# EAGLE design SparkFun_GPS_ZED-F9K (EAGLE 9.5.2)
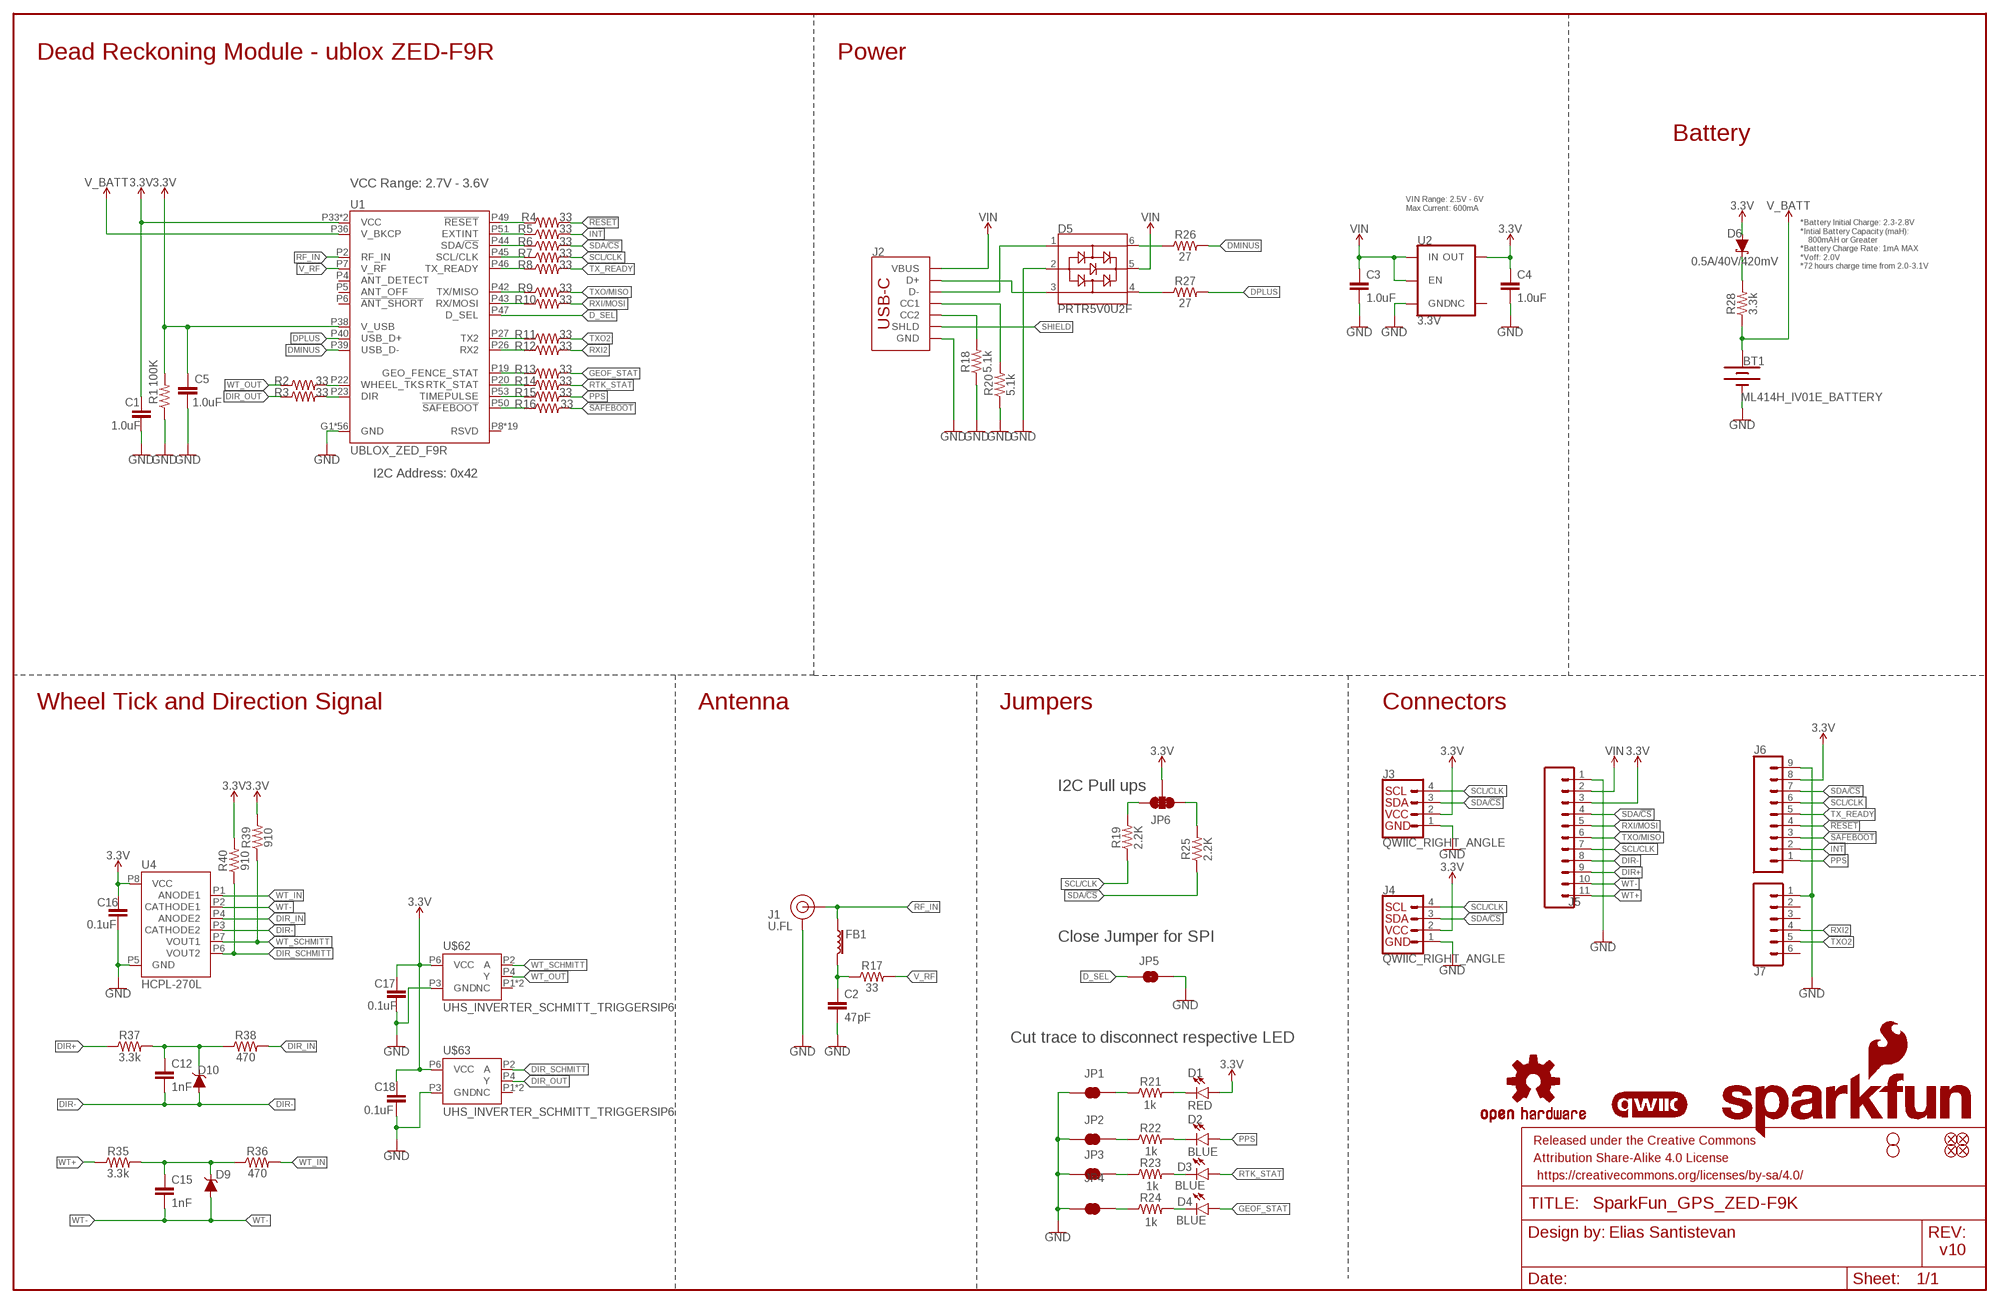
[diagram p0: schematic, sheet 1]

## Parts
$1_36_$_2020-02-13_17-32-45  STAND-OFFTIGHT  [STAND-OFF-TIGHT]
BT1  ML414H_IV01E_BATTERY  [ML414H_IV01E]
C1  1.0uF  1.0UF-0603-16V-10%-X7R  [0603]
C2  47pF  47PF-0402-25V-5%-X7R  [0402]
C3  1.0uF  1.0UF-0603-16V-10%-X7R  [0603]
C4  1.0uF  1.0UF-0603-16V-10%-X7R  [0603]
C5  1.0uF  1.0UF-0603-16V-10%-X7R  [0603]
C12  1nF  1.0NF/1000PF-0402-25V-10%-X7R  [0402]
C15  1nF  1.0NF/1000PF-0402-25V-10%-X7R  [0402]
C16  0.1uF  0.1UF-0402-6.3V-10%-X7R  [0402]
C17  0.1uF  0.1UF-0402-6.3V-10%-X7R  [0402]
C18  0.1uF  0.1UF-0402-6.3V-10%-X7R  [0402]
D1  RED  LED-RED0603  [LED-0603]
D2  BLUE  LED-BLUE0603  [LED-0603]
D3  BLUE  LED-BLUE0603  [LED-0603]
D4  BLUE  LED-BLUE0603  [LED-0603]
D5  PRTR5V0U2F  [SOT886]
D6  0.5A/40V/420mV  DIODE-SCHOTTKY-PMEG4005EJ  [SOD-323]
D9  0.5A/40V/420mV  BZX84_DIODE  [SOT23_BZX]
D10  0.5A/40V/420mV  BZX84_DIODE  [SOT23_BZX]
FB1  120NH  FERRITE_BEAD_GNSS  [0402_MURATA]
FD1  FIDUCIALUFIDUCIAL  [FIDUCIAL-MICRO]
FD2  FIDUCIALUFIDUCIAL  [FIDUCIAL-MICRO]
FD3  FIDUCIALUFIDUCIAL  [FIDUCIAL-MICRO]
FD4  FIDUCIALUFIDUCIAL  [FIDUCIAL-MICRO]
FRAME1  FRAME-LEDGER  [CREATIVE_COMMONS]
H2  STAND-OFFTIGHT  [STAND-OFF-TIGHT]
J1  U.FL  U.FL2PIN  [U.FL]
J2  USB_C_2-LAYER_PADS  [USB-C-16P-2LAYER-PADS]
J3  QWIIC_RIGHT_ANGLE  QWIIC_CONNECTORJS-1MM  [JST04_1MM_RA]
J4  QWIIC_RIGHT_ANGLE  QWIIC_CONNECTORJS-1MM  [JST04_1MM_RA]
J5  CONN_111X11_NO_SILK  [1X11_NO_SILK]
J6  CONN_09NO_SILK  [1X09_NO_SILK]
J7  CONN_06NO_SILK_NO_POP  [1X06_NO_SILK]
JP1  JUMPER-SMT_2_NC_TRACE_SILK  [SMT-JUMPER_2_NC_TRACE_SILK]
JP2  JUMPER-SMT_2_NC_TRACE_SILK  [SMT-JUMPER_2_NC_TRACE_SILK]
JP3  JUMPER-SMT_2_NC_TRACE_SILK  [SMT-JUMPER_2_NC_TRACE_SILK]
JP4  JUMPER-SMT_2_NC_TRACE_SILK  [SMT-JUMPER_2_NC_TRACE_SILK]
JP5  JUMPER-SMT_2_NO_SILK  [SMT-JUMPER_2_NO_SILK]
JP6  JUMPER-SMT_3_2-NC_TRACE_SILK  [SMT-JUMPER_3_2-NC_TRACE_SILK]
LOGO1  OSHW-LOGOM  [OSHW-LOGO-M]
LOGO2  QWIIC_LOGO_4MM  [QWIIC_4MM]
LOGO3  SFE_LOGO_NAME_FLAME.2_INCH  [SFE_LOGO_NAME_FLAME_.2]
R1  100K  100KOHM-0402-1/16W-1%  [0402]
R2  33  33OHM-0402-1/10W-1%  [0402]
R3  33  33OHM-0402-1/10W-1%  [0402]
R4  33  33OHM-0402-1/10W-1%  [0402]
R5  33  33OHM-0402-1/10W-1%  [0402]
R6  33  33OHM-0402-1/10W-1%  [0402]
R7  33  33OHM-0402-1/10W-1%  [0402]
R8  33  33OHM-0402-1/10W-1%  [0402]
R9  33  33OHM-0402-1/10W-1%  [0402]
R10  33  33OHM-0402-1/10W-1%  [0402]
R11  33  33OHM-0402-1/10W-1%  [0402]
R12  33  33OHM-0402-1/10W-1%  [0402]
R13  33  33OHM-0402-1/10W-1%  [0402]
R14  33  33OHM-0402-1/10W-1%  [0402]
R15  33  33OHM-0402-1/10W-1%  [0402]
R16  33  33OHM-0402-1/10W-1%  [0402]
R17  33  33OHM-0603-1/10W-1%  [0603]
R18  5.1k  5.1KOHM-0402-1/16W-1%  [0402]
R19  2.2K  2.2KOHM-0402-1/16W-1%  [0402]
R20  5.1k  5.1KOHM-0402-1/16W-1%  [0402]
R21  1KOHM-0402-1/16W-1%  [0402]
R22  1KOHM-0402-1/16W-1%  [0402]
R23  1KOHM-0402-1/16W-1%  [0402]
R24  1KOHM-0402-1/16W-1%  [0402]
R25  2.2K  2.2KOHM-0402-1/16W-1%  [0402]
R26  27  27OHM-0603-1/10W-1%  [0603]
R27  27  27OHM-0603-1/10W-1%  [0603]
R28  3.3k  3.3KOHM-0603-1/10W-1%  [0603]
R35  3.3k  3.3KOHM-0603-1/10W-1%  [0603]
R36  470  470OHM-0603-1/10W-1%  [0603]
R37  3.3k  3.3KOHM-0603-1/10W-1%  [0603]
R38  470  470OHM-0603-1/10W-1%  [0603]
R39  910  910OHM-0603-1/10W-5%  [0603]
R40  910  910OHM-0603-1/10W-5%  [0603]
U1  UBLOX_ZED_F9R  [UBLOX_ZED_F9R]
U2  3.3V  V_REG_AP2112K-3.3V  [SOT23-5]
U4  HCPL-270L  [SOP_8-PIN]
U$62  UHS_INVERTER_SCHMITT_TRIGGERSIP6  [SIP6]
U$63  UHS_INVERTER_SCHMITT_TRIGGERSIP6  [SIP6]

## Nets
3.3V: C1.1 C4.1 C5.1 C16.1 C17.1 C18.1 D1.A D6.A J3.2 J4.2 J5.3 J6.8 JP6.2 R1.2 R39.2 R40.2 U1.P33(VCC) U1.P34(VCC) U1.P38(V_USB) U2.5(OUT) U4.P8(VCC) U$62.P6(VCC) U$63.P6(VCC)
!RESET: J6.4 R4.2
!SAFEBOOT: J6.3 R16.2
D_SEL: JP5.1 U1.P47(D_SEL)
DIR+: J5.9 R37.1
DIR-: C12.2 D10.P1(A) J5.8 U4.P3(CATHODE2)
DIR_IN: R38.2 U4.P4(ANODE2)
DIR_OUT: R3.1 U$63.P4(Y)
DIR_SCHMITT: R40.1 U4.P6(VOUT2) U$63.P2(A)
DMINUS: R26.2 U1.P39(USB_D-)
DPLUS: R27.2 U1.P40(USB_D+)
GEOF_STAT: D4.A R13.2
GND: BT1.- C1.2 C2.2 C3.2 C4.2 C5.2 C16.2 C17.2 C18.2 D5.2 J1.1(GND) J1.2(GND) J2.GND J2.GND2(GND) J3.1 J4.1 J5.1 J6.9 J7.1 JP1.1 JP2.1 JP3.1 JP4.1 JP5.2 R1.1 R18.1 R20.1 U1.G1(GND) U1.G2(GND) U1.G3(GND) U1.G4(GND) U1.G5(GND) U1.G6(GND) U1.G7(GND) U1.G8(GND) U1.G9(GND) U1.G10(GND) U1.G11(GND) U1.G12(GND) U1.G13(GND) U1.G14(GND) U1.G15(GND) U1.G16(GND) U1.G17(GND) U1.G18(GND) U1.G19(GND) U1.G20(GND) U1.G21(GND) U1.G22(GND) U1.G23(GND) U1.G24(GND) U1.G25(GND) U1.G26(GND) U1.G27(GND) U1.G28(GND) U1.G29(GND) U1.G30(GND) U1.G31(GND) U1.G32(GND) U1.G33(GND) U1.G34(GND) U1.G35(GND) U1.G36(GND) U1.G37(GND) U1.G38(GND) U1.G39(GND) U1.G40(GND) U1.G41(GND) U1.G42(GND) U1.G43(GND) U1.G44(GND) U1.G45(GND) U1.G46(GND) U1.G47(GND) U1.G48(GND) U1.P1(GND) U1.P3(GND) U1.P12(GND) U1.P14(GND) U1.P32(GND) U1.P37(GND) U1.P41(GND) U1.P48(GND) U2.2(GND) U4.P5(GND) U$62.P3(GND) U$63.P3(GND)
INT: J6.2 R5.2
N$1: JP6.1 R25.2
N$2: D6.C R28.2
N$3: JP6.3 R19.2
N$4: D1.C R21.2
N$5: C2.1 FB1.P2 R17.1
N$6: D5.3 J2.A6(D+) J2.B6(D+)
N$7: D5.1 J2.A7(D-) J2.B7(D-)
N$8: JP1.2 R21.1
N$9: D5.6 R26.1
N$10: D5.4 R27.1
N$11: R4.1 U1.P49(!RESET!)
N$12: R5.1 U1.P51(EXTINT)
N$14: J2.B5(CC2) R18.2
N$15: J2.A5(CC1) R20.2
N$16: R6.1 U1.P44(SDA/!CS!)
N$17: R7.1 U1.P45(SCL/CLK)
N$18: R8.1 U1.P46(TX_READY)
N$19: R9.1 U1.P42(TX/MISO)
N$20: R10.1 U1.P43(RX/MOSI)
N$21: R11.1 U1.P27(TX2)
N$22: JP3.2 R23.1
N$23: JP2.2 R22.1
N$24: D2.C R22.2
N$25: D3.C R23.2
N$26: R12.1 U1.P26(RX2)
N$27: R13.1 U1.P19(GEO_FENCE_STAT)
N$28: R14.1 U1.P20(RTK_STAT)
N$29: R15.1 U1.P53(TIMEPULSE)
N$30: R16.1 U1.P50(!SAFEBOOT!)
N$31: R2.2 U1.P22(WHEEL_TKS)
N$32: R3.2 U1.P23(DIR)
N$33: JP4.2 R24.1
N$34: D4.C R24.2
N$35: C15.1 D9.P3(C) R35.2 R36.1
N$37: C12.1 D10.P3(C) R37.2 R38.1
PPS: D2.A J6.1 R15.2
RF_IN [Antenna]: FB1.P1 J1.FEED(SIGNAL) U1.P2(RF_IN)
RTK_STAT: D3.A R14.2
RXI2: J7.4 R12.2
RXI/MOSI: J5.5 R10.2
SCL/CLK: J3.4 J4.4 J5.7 J6.6 R7.2 R19.1
SDA/!CS: J3.3 J4.3 J5.4 J6.7 R6.2 R25.1
SHIELD: J2.SHLD1(SHLD) J2.SHLD2(SHLD) J2.SHLD3(SHLD) J2.SHLD4(SHLD)
TX_READY: J6.5 R8.2
TXO2: J7.5 R11.2
TXO/MISO: J5.6 R9.2
V_BATT: BT1.+ R28.1 U1.P36(V_BKCP)
V_RF: R17.2 U1.P7(V_RF)
VIN: C3.1 D5.5 J2.VBUS1(VBUS) J2.VBUS2(VBUS) J5.2 U2.1(IN) U2.3(EN)
WT+: J5.11 R35.1
WT-: C15.2 D9.P1(A) J5.10 U4.P2(CATHODE1)
WT_IN: R36.2 U4.P1(ANODE1)
WT_OUT: R2.1 U$62.P4(Y)
WT_SCHMITT: R39.1 U4.P7(VOUT1) U$62.P2(A)
Unconnected: J7.2 J7.3 J7.6 U1.P4(ANT_DETECT) U1.P5(ANT_OFF) U1.P6(!ANT_SHORT!) U1.P8(RSVD) U1.P9(RSVD) U1.P10(RSVD) U1.P11(RSVD) U1.P13(RSVD) U1.P15(RSVD) U1.P16(RSVD) U1.P17(RSVD) U1.P18(RSVD) U1.P21(RSVD) U1.P24(RSVD) U1.P25(RSVD) U1.P28(RSVD) U1.P29(RSVD) U1.P30(RSVD) U1.P31(RSVD) U1.P35(RSVD) U1.P52(RSVD) U1.P54(RSVD) U2.4(NC) U$62.P1(NC) U$62.P5(NC) U$63.P1(NC) U$63.P5(NC)

## Notes on the sheet
- Dead Reckoning Module - ublox ZED-F9R | Power
- Battery
- VCC Range: 2.7V - 3.6V
- VIN Range: 2.5V - 6V
  Max Current: 600mA
- *Battery Initial Charge: 2.3-2.8V
  *Intial Battery Capacity (maH): 
      800mAH or Greater
  *Battery Charge Rate: 1mA MAX
  *Voff: 2.0V
  *72 hours charge time from 2.0-3.1V
- I2C Address: 0x42
- Wheel Tick and Direction Signal | Antenna | Jumpers | Connectors
- I2C Pull ups
- Close Jumper for SPI
- Cut trace to disconnect respective LED
- 1k
- 1k
- 1k
- 1k
- Elias Santistevan
- v10

## Library data of the parts
$1_36_$_2020-02-13_17-32-45 H2 = SparkFun-Hardware:STAND-OFF: Stand Off Drill holes for mechanically mounting via screws, standoffs, etc. Note: Use the keepout ring to avoid running the screw head into surrounding components. Variant Overviews STAND-OFF - Mechanical footprint for a #4 phillips button head screw. STAND-OFF-TIGHT - Mechanical footprint for a #4 phillips button head screw, Example SparkFun Products Screw - Phillips Head (1/4", 4-40, 10 pack) <https://www.sparkfun.com/products/10453> (PRT-10453) Screw - Phillips Head (1/2", 4-40, 10 pack) <https://www.sparkfun.com/products/10452> (PRT-10452) Screw - Phillips Head (3/4", 4-40, 10 pack) <https://www.sparkfun.com/products/10451> (PRT-10451) Screw - Phillips Head (1", 4-40, 10 pack) <https://www.sparkfun.com/products/10450> (PRT-10450)
BT1 = SparkFun-Batteries:ML414H_IV01E_BATTERY: SEIKO ML414H-IV01E Reflowable Lithium Battery ML414H is a rechargeable, coin type battery with features such as Pb-free reflowable (Peak temperature: 260 C) and high temperature heat resistance. Battery Characteristics: 3.1V max voltage Voff is 2V 1mAH 3k series resistor with battery 72 hour charge time from 2.0-3.1V 2.3-2.8V initial charge; PROD_ID: BATT-14267
C1 C3-C5 = SparkFun-Capacitors:1.0UF: 1µF ceramic capacitors A capacitor is a passive two-terminal electrical component used to store electrical energy temporarily in an electric field.; PROD_ID: CAP-13930
C2 = SparkFun-Capacitors:47PF: 47pF ceramic capacitors A capacitor is a passive two-terminal electrical component used to store electrical energy temporarily in an electric field.; PROD_ID: CAP-15063
C12 C15 = SparkFun-Capacitors:1.0NF/1000PF: 1nF/1,000pF ceramic capacitors A capacitor is a passive two-terminal electrical component used to store electrical energy temporarily in an electric field.; PROD_ID: CAP-15061
C16-C18 = SparkFun-Capacitors:0.1UF: 0.1µF ceramic capacitors A capacitor is a passive two-terminal electrical component used to store electrical energy temporarily in an electric field.; PROD_ID: CAP-14993
D1 = SparkFun-LED:LED-RED: Red SMD LED Used in manufacturing of most products at SparkFun Packages: 0603 - SMD 0603 package [Product Link] <http://docs.avagotech.com/docs/AV02-0551EN> 0603 SMART - SMD 0603 SMART package ( more efficient and expensive)[Product Link] <http://www.osram-os.com/Graphics/XPic2/00077099_0.pdf> 1206 - SMD1206 package [Product Link] <https://www.sparkfun.com/datasheets/DevTools/LilyPad/Q150OVS4.pdff> SparkFun Products: Pro Mini 328 -5V <https://www.sparkfun.com/products/821> RedBoard <https://www.sparkfun.com/products/12757> IOIO-OTG <https://www.sparkfun.com/products/13613>; PROD_ID: DIO-00819
D2-D4 = SparkFun-LED:LED-BLUE: Blue SMD LED Used in manufacturing of various products at SparkFun Packages: 0603 - SMD 0603 package [Product Link] <http://www.digikey.com/product-detail/en/SMLE12BC7TT86/511-1589-2-ND/1641808> 1206 - SMD1206 package [Product Link] <http://www.digikey.com/product-detail/en/lite-on-inc/LTST-C150TBKT/160-1643-1-ND/573584> SparkFun Products: ESP8266 Thing-Dev Board <https://www.sparkfun.com/products/13711> RedBoard <https://www.sparkfun.com/products/12757>; PROD_ID: DIO-08575
D5 = SparkFun-IC-Power:PRTR5V0U2: A small ESD protection device. Most commonly used on USB D+/D- signals to protect large, expensive, or especially sensitive USB enabled devices.; PROD_ID: DIO-14084
D6 = SparkFun-DiscreteSemi:DIODE-SCHOTTKY: Schottky diode A Schottky diode is a semiconductor diode which has a low forward voltage drop and a very fast switching action.; PROD_ID: DIO-10955
D9 D10 = classified:BZX84_DIODE
FB1 = SparkFun-Coils:FERRITE_BEAD_GNSS
FD1-FD4 = SparkFun-Aesthetics:FIDUCIAL: Fiducial Alignment Points Point-of-reference for pick-and-place machines and other optical instruments.
FRAME1 = SparkFun-Aesthetics:FRAME-LEDGER: Schematic Frame - Ledger Standard 11x14 US Ledger frame
J1 = SparkFun-Connectors:U.FL2PIN: SMD Antenna Connector - U.FL 2mm height, 3.0mm x 3.0mm receptacle size. SparkFun Products: SparkFun WiFi Shield - ESP8266 <https://www.sparkfun.com/products/13287> SparkFun ESP8266 Thing <https://www.sparkfun.com/products/13231> SparkFun MiniGen - Pro Mini Signal Generator Shield <https://www.sparkfun.com/products/11420>; PROD_ID: CONN-09193; SF_ID: WRL-09144
J2 = SparkFun-Connectors:USB_C: USB Type C 16Pin Connector Super Speed pins not available on the 16-pin purely SMD connector so this part is best for USB 2.0 implementations. D1 and D2 are tied together enabling D+/- no matter which way the cable is plugged into the connector. The two channel configuration pins (CC1/2) are exposed. These are normally connected to ground via 5.1k resistors but can be reconfigured for high current/high power applications.; PROD_ID: CONN-14122
J3 J4 = SparkFun-Connectors:QWIIC_CONNECTOR: SparkFun I2C Standard Qwiic Connector An SMD 1mm pitch JST connector makes it easy and quick (get it? Qwiic?) to connect I2C devices to each other. The Qwiic system <http://www.sparkfun.com/qwiic> enables fast and solderless connection between popular platforms and various sensors and actuators. We carry 200mm <https://www.sparkfun.com/products/14204>, 100mm <https://www.sparkfun.com/products/14205>, 50mm <https://www.sparkfun.com/products/14206>, and breadboard friendly <https://www.sparkfun.com/products/14207> Qwiic cables. We also offer 10 pcs strips <https://www.sparkfun.com/products/14323> the SMD connectors.; PROD_ID: CONN-13694
J5 = SparkFun-Connectors:CONN_11: Multi connection point. Often used as Generic Header-pin footprint for 0.1 inch spaced/style header connections On any of the 0.1 inch spaced packages, you can populate with these: Break Away Headers - Straight <https://www.sparkfun.com/products/116> (PRT-00116) Break Away Male Headers - Right Angle <https://www.sparkfun.com/products/553> (PRT-00553) Female Headers <https://www.sparkfun.com/products/115> (PRT-00115) Break Away Headers - Machine Pin <https://www.sparkfun.com/products/117> (PRT-00117) Break Away Female Headers - Swiss Machine Pin <https://www.sparkfun.com/products/743> (PRT-00743) For SCREWTERMINALS and SPRING TERMINALS visit here: Screw Terimnals on SparkFun.com <https://www.sparkfun.com/search/results?term=Screw+Terminals> (5mm/3.5mm/2.54mm spacing) This device is also useful as a general connection point to wire up your design to another part of your project. Our various solder wires solder well into these plated through hole pads. Hook-Up Wire - Assortment (Stranded, 22 AWG) <https://www.sparkfun.com/products/11375> (PRT-11375) Hook-Up Wire - Assortment (Solid Core, 22 AWG) <https://www.sparkfun.com/products/11367> (PRT-11367) View the entire wire category on our website here <https://www.sparkfun.com/categories/141>
J6 = SparkFun-Connectors:CONN_09: Multi connection point. Often used as Generic Header-pin footprint for 0.1 inch spaced/style header connections On any of the 0.1 inch spaced packages, you can populate with these: Break Away Headers - Straight <https://www.sparkfun.com/products/116> (PRT-00116) Break Away Male Headers - Right Angle <https://www.sparkfun.com/products/553> (PRT-00553) Female Headers <https://www.sparkfun.com/products/115> (PRT-00115) Break Away Headers - Machine Pin <https://www.sparkfun.com/products/117> (PRT-00117) Break Away Female Headers - Swiss Machine Pin <https://www.sparkfun.com/products/743> (PRT-00743) For SCREWTERMINALS and SPRING TERMINALS visit here: Screw Terimnals on SparkFun.com <https://www.sparkfun.com/search/results?term=Screw+Terminals> (5mm/3.5mm/2.54mm spacing) This device is also useful as a general connection point to wire up your design to another part of your project. Our various solder wires solder well into these plated through hole pads. Hook-Up Wire - Assortment (Stranded, 22 AWG) <https://www.sparkfun.com/products/11375> (PRT-11375) Hook-Up Wire - Assortment (Solid Core, 22 AWG) <https://www.sparkfun.com/products/11367> (PRT-11367) View the entire wire category on our website here <https://www.sparkfun.com/categories/141> Special notes: Molex polarized connector foot print use with SKU : PRT-08231 with associated crimp pins and housings. 1MM SMD Version SKU: PRT-10208 NOTES ON THE VARIANTS LOCK and LOCK_LONGPADS... This footprint was designed to help hold the alignment of a through-hole component (i.e. 6-pin header) while soldering it into place. You may notice that each hole has been shifted either up or down by 0.005 of an inch from it's more standard position (which is a perfectly straight line). This slight alteration caused the pins (the squares in the middle) to touch the edges of the holes. Because they are alternating, it causes a "brace" to hold the component in place. 0.005 has proven to be the perfect amount of "off-center" position when using our standard breakaway headers. Although looks a little odd when you look at the bare footprint, once you have a header in there, the alteration is very hard to notice. Also,if you push a header all the way into place, it is covered up entirely on the bottom side.
J7 = SparkFun-Connectors:CONN_06: Multi connection point. Often used as Generic Header-pin footprint for 0.1 inch spaced/style header connections On any of the 0.1 inch spaced packages, you can populate with these: Break Away Headers - Straight <https://www.sparkfun.com/products/116> (PRT-00116) Break Away Male Headers - Right Angle <https://www.sparkfun.com/products/553> (PRT-00553) Female Headers <https://www.sparkfun.com/products/115> (PRT-00115) Break Away Headers - Machine Pin <https://www.sparkfun.com/products/117> (PRT-00117) Break Away Female Headers - Swiss Machine Pin <https://www.sparkfun.com/products/743> (PRT-00743) Arduino Stackable Header - 6 Pin <https://www.sparkfun.com/products/9280> (PRT-09280) For SCREWTERMINALS and SPRING TERMINALS visit here: Screw Terimnals on SparkFun.com <https://www.sparkfun.com/search/results?term=Screw+Terminals> (5mm/3.5mm/2.54mm spacing) This device is also useful as a general connection point to wire up your design to another part of your project. Our various solder wires solder well into these plated through hole pads. Hook-Up Wire - Assortment (Stranded, 22 AWG) <https://www.sparkfun.com/products/11375> (PRT-11375) Hook-Up Wire - Assortment (Solid Core, 22 AWG) <https://www.sparkfun.com/products/11367> (PRT-11367) View the entire wire category on our website here <https://www.sparkfun.com/categories/141>
JP1-JP4 = SparkFun-Jumpers:JUMPER-SMT_2_NC_TRACE: Normally closed trace jumper This jumper has a trace between two pads so it's normally closed (NC). Use a razor knife to open the connection. For best results follow the IPC guidelines for cutting traces: Cutout at least 0.063 mm (0.005 in). Remove all loose material to clean up the cut area. Seal the cut with an approved epoxy. Reapply solder to reclose the connection.
JP5 = SparkFun-Jumpers:JUMPER-SMT_2_NO: Normally open jumper This jumper has two pads in close proximity to each other. Apply solder to close the connection. Round pads are easier to solder for beginners, but are a lot larger. SparkFun Product that uses the round pads: SparkFun EL Sequencer <https://www.sparkfun.com/products/12781>
JP6 = SparkFun-Jumpers:JUMPER-SMT_3_2-NC_TRACE: Normally closed trace jumper (2 of 2 connections) This jumper has a trace between all three pads so they are normally closed (NC). Use a razor knife to open the connection(s). For best results follow the IPC guidelines for cutting traces: Cutout at least 0.063 mm (0.005 in). Remove all loose material to clean up the cut area. Seal the cut with an approved epoxy. Reapply solder to reclose the connection(s).
LOGO1 = SparkFun-Aesthetics:OSHW-LOGO: Open-Source Hardware (OSHW) Logo This logo indicates the piece of hardware it is found on incorporates a OSHW license and/or adheres to the definition of open source hardware found here: http://freedomdefined.org/OSHW
LOGO2 = SparkFun-Aesthetics:QWIIC_LOGO: Qwiic Logos for placement on schematic and PCB. The 5.5mm silk logo is best for placing next to Qwiic connector.
LOGO3 = SparkFun-Aesthetics:SFE_LOGO_NAME_FLAME: SparkFun Font Logo w/ Flame This is the SparkFun full logo. The logo on the schematic will always be the same size; the package variant is the height of the flame part of the logo. Default layer for the logo on the board is tSilk.
R1 = SparkFun-Resistors:100KOHM: 100kΩ resistor A resistor is a passive two-terminal electrical component that implements electrical resistance as a circuit element. Resistors act to reduce current flow, and, at the same time, act to lower voltage levels within circuits. - Wikipedia; PROD_ID: RES-13495
R2-R16 = SparkFun-Resistors:33OHM: 33Ω resistor A resistor is a passive two-terminal electrical component that implements electrical resistance as a circuit element. Resistors act to reduce current flow, and, at the same time, act to lower voltage levels within circuits. - Wikipedia; PROD_ID: RES-14883
R17 = SparkFun-Resistors:33OHM: 33Ω resistor A resistor is a passive two-terminal electrical component that implements electrical resistance as a circuit element. Resistors act to reduce current flow, and, at the same time, act to lower voltage levels within circuits. - Wikipedia; PROD_ID: RES-08270
R18 R20 = SparkFun-Resistors:5.1KOHM; PROD_ID: RES-14340
R19 R25 = SparkFun-Resistors:2.2KOHM: 2.2kΩ resistor A resistor is a passive two-terminal electrical component that implements electrical resistance as a circuit element. Resistors act to reduce current flow, and, at the same time, act to lower voltage levels within circuits. - Wikipedia; PROD_ID: RES-14341
R21-R24 = SparkFun-Resistors:1KOHM: 1kΩ resistor A resistor is a passive two-terminal electrical component that implements electrical resistance as a circuit element. Resistors act to reduce current flow, and, at the same time, act to lower voltage levels within circuits. - Wikipedia; PROD_ID: RES-14342
R26 R27 = SparkFun-Resistors:27OHM: 27Ω resistor A resistor is a passive two-terminal electrical component that implements electrical resistance as a circuit element. Resistors act to reduce current flow, and, at the same time, act to lower voltage levels within circuits. - Wikipedia; PROD_ID: RES-09334
R28 R35 R37 = SparkFun-Resistors:3.3KOHM: 3.3kΩ resistor A resistor is a passive two-terminal electrical component that implements electrical resistance as a circuit element. Resistors act to reduce current flow, and, at the same time, act to lower voltage levels within circuits. - Wikipedia; PROD_ID: RES-07851
R36 R38 = SparkFun-Resistors:470OHM: 470Ω resistor A resistor is a passive two-terminal electrical component that implements electrical resistance as a circuit element. Resistors act to reduce current flow, and, at the same time, act to lower voltage levels within circuits. - Wikipedia; PROD_ID: RES-07869
R39 R40 = classified:910OHM-0603-1/10W-5%: 910 Ohm Resistor Digikey Link <https://www.digikey.com/product-detail/en/yageo/RC0603JR-07910RL/311-910GRTR-ND/726838>
U1 = classified:UBLOX_ZED_F9R: u-blox ZED-F9K ADR GPS Unit with Real Time Kinematics (RTK) and internal IMU = Automotive Dead Reckoning; PROD_ID: IC-14716
U2 = SparkFun-IC-Power:V_REG_AP2112: AP2112 - 600mA CMOS LDO Regulator w/ Enable The AP2112 is CMOS process low dropout linear regulator with enable function, the regulator delivers a guaranteed 600mA (min.) continuous load current. Features Output Voltage Accuracy: ±1.5% Output Current: 600mA (Min.) Foldback Short Current Protection: 50mA Enable Function to Turn ON/OFF VOUT Low Dropout Voltage (3.3V): 250mV (Typ.) @IOUT=600mA Excellent Load Regulation: 0.2%/A (Typ.) Excellent Line Regulation: 0.02%/V (Typ.) Low Quiescent Current: 55μA (Typ.) Low Standby Current: 0.01μA (Typ.) Low Output Noise: 50μVRMS PSRR: 100Hz -65dB, 1kHz -65dB OTSD Protection Stable with 1.0μF Flexible Cap: Ceramic, Tantalum and Aluminum Electrolytic Operation Temperature Range: -40°C to 85°C ESD: MM 400V, HBM 4000V; PROD_ID: VREG-12457
U4 = classified:HCPL-270L: HCPL-270L These high gain series couplers use a Light Emitting Diode and an integrated high gain photodetector to provide extremely high current transfer ratio between input and output. Separate pins for the photodiode and output stage result in LVTTL compatible saturation voltages and high speed operation. Where desired, the VCC and VO terminals may be tied together to achieve conventional photo-darlington operation. A base access terminal allows a gain bandwidth adjustment to be made. These optocouplers are for use in LVTTL/LVCMOS or other low power applications. A 400% minimum current transfer ratio is guaranteed over 0 to +70˚C operating range for only 0.5 mA of LED current. Digikey Link <https://www.digikey.com/products/en?mpart=HCPL-070L-500E&v=516>
U$62 U$63 = classified:UHS_INVERTER_SCHMITT_TRIGGER: NC7SZ14 The NC7SZ14 is a single inverter with Schmitt trigger input from ON Semiconductor’s Ultra−High Speed (UHS) series of TinyLogic. The device is fabricated w ith advanced CMOS technology to achieve ultra−high speed with high output drive while maintaining low static power dissipation over a very broad VCC operating range. The device is specified to operate over the 1.65 V to 5.5 V VCC range. The inputs and outputs are high−impedance when VCC is 0 V. Inputs tolerate voltages up to 5.5 V independent of VCC operating voltage. Digikey Link <https://www.digikey.com/product-detail/en/on-semiconductor/NC7SZ14M5X/NC7SZ14M5XDKR-ND/1628606>

## Net classes
1 Antenna: width 1 mm, clearance 0.3 mm

## Board
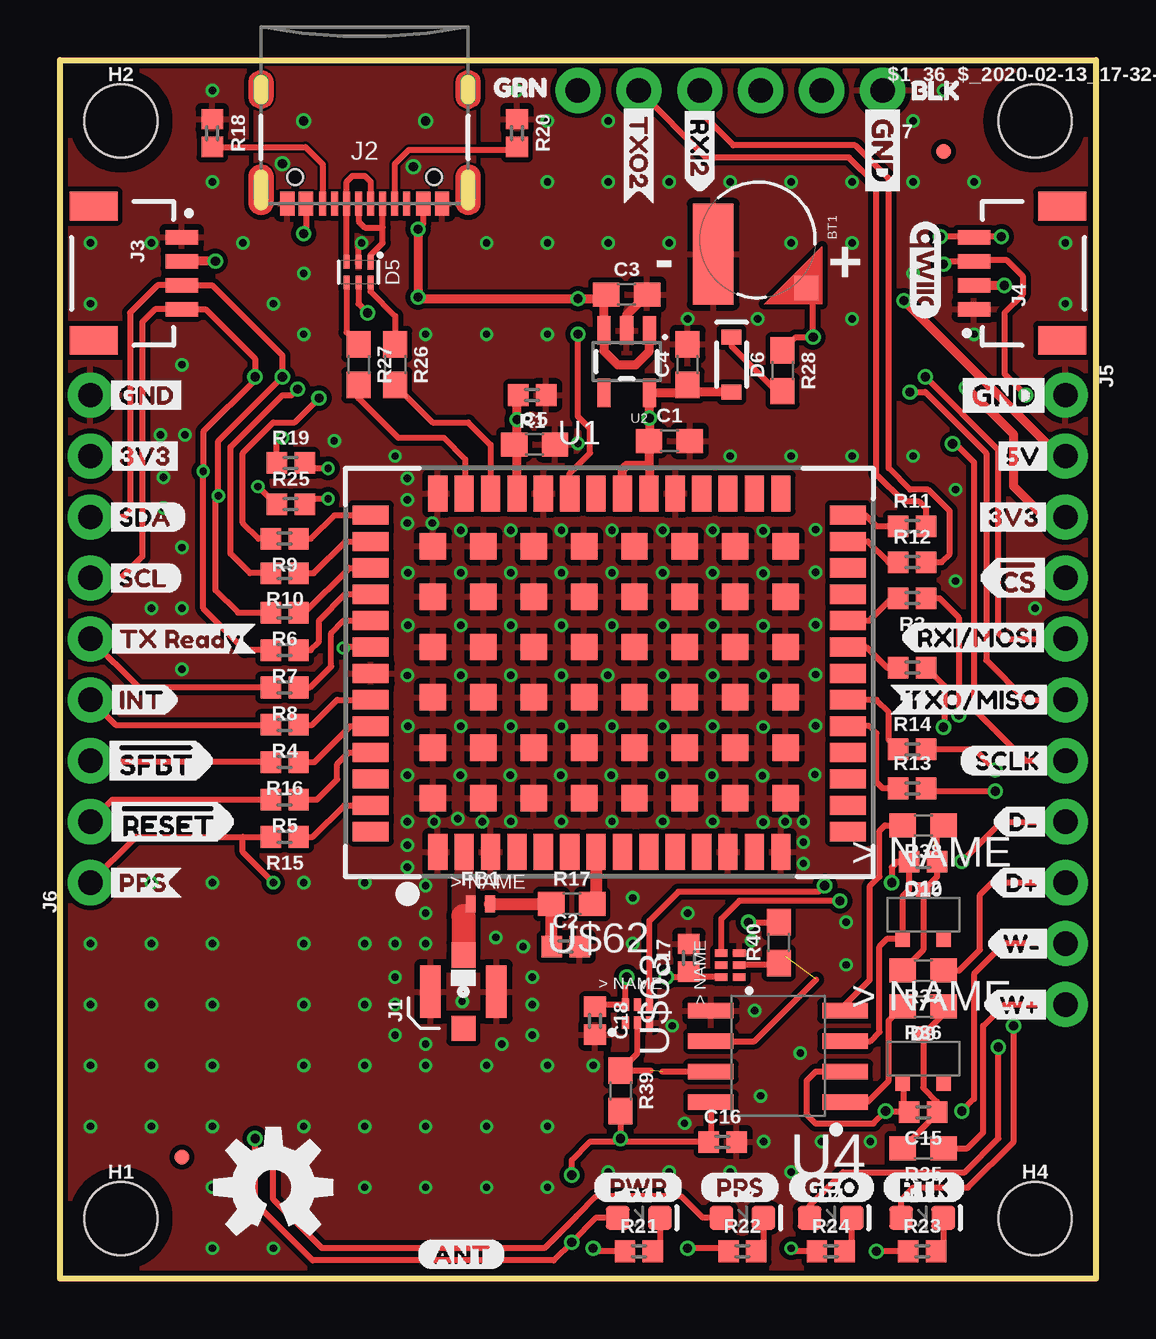
[diagram p1: board, top side]
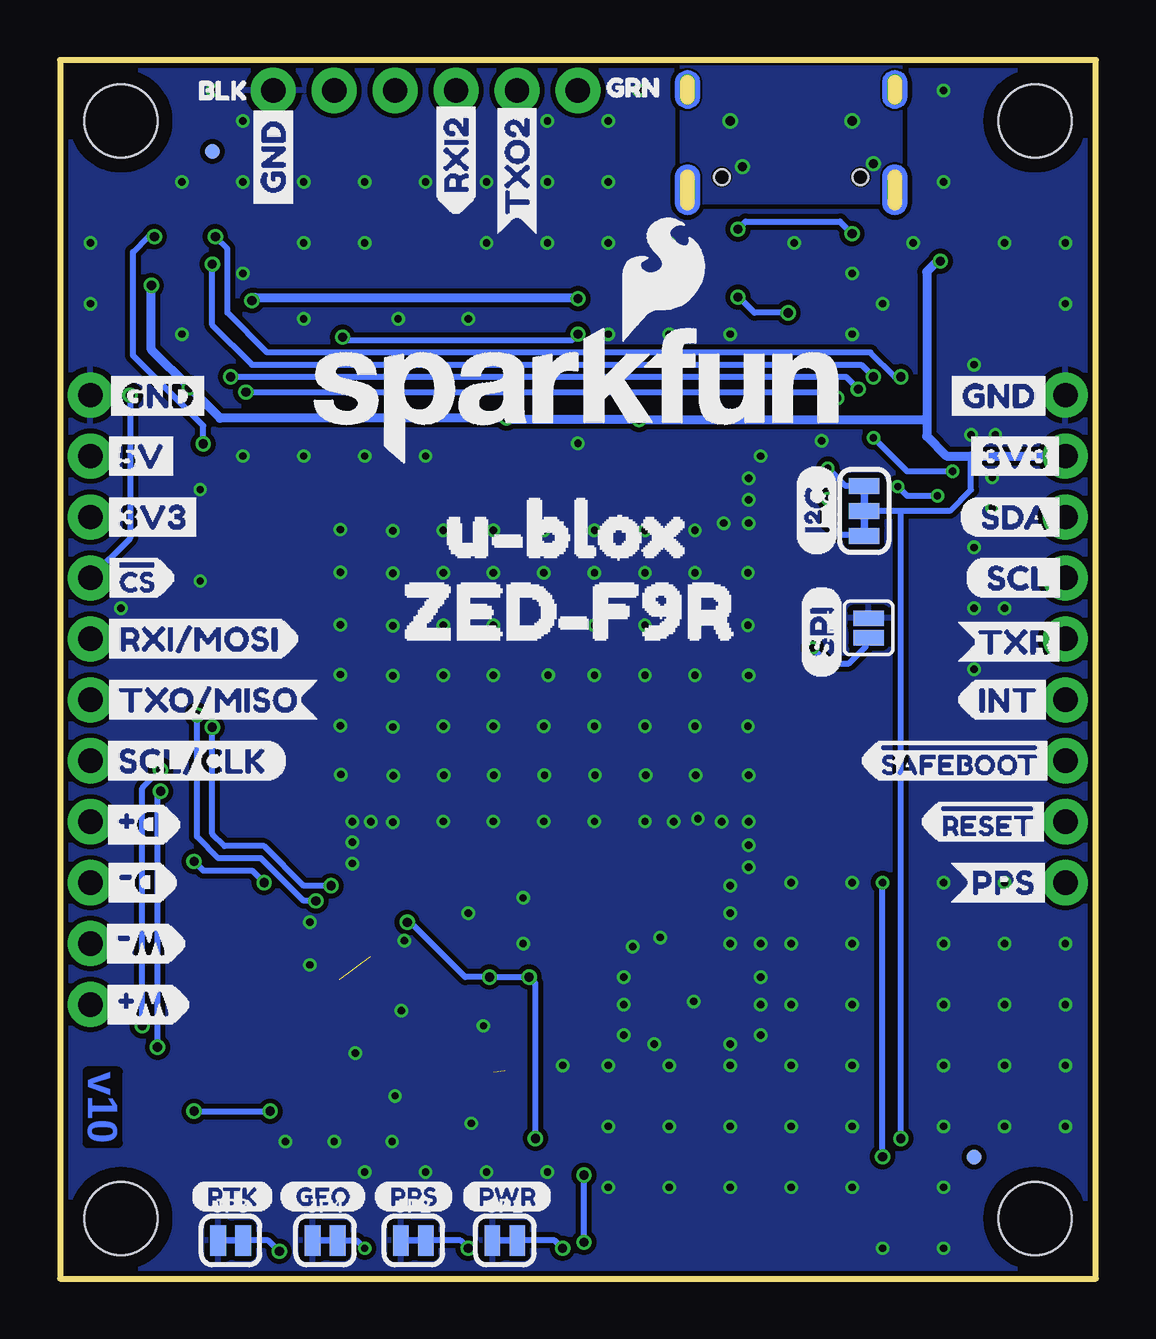
[diagram p2: board, bottom side, seen from below]

Size 43.18 x 50.8 mm. Coordinates in mm from the lower left corner, seen from the top.
Outline: 0,0 0,50.8 43.18,50.8 43.18,0 0,0
Copper layers (1*16): Top 0.035mm / dielectric 1.5mm / Bottom 0.035mm
Design rules "SparkFun-2-layer-FAB-LIMIT": minimum track width 4mil, minimum drill 6mil, track to track 4mil, track to pad 4mil, pad to pad 4mil, via to via 4mil, smd to smd 4mil, copper to edge 4mil, drill to drill 4mil, minimum pad ring 5mil, minimum via ring 5mil, stop-mask expansion 4mil, vias tented up to drill 25mil, thermal gap 10mil

### Footprints (pad centres in the part's own frame; a part is rotated, then mirrored left to right if it is on the bottom)
STAND-OFF-TIGHT = hole 3.048: 0,0
ML414H_IV01E = smd 1 x 1: + 2.022,2.032 | smd 4.2 x 1.7: - 0.6,-1.85
0603 = smd 1.1 x 1: 1 -0.85,0; 2 0.85,0
0402 = smd 0.85 x 0.9: 1 -0.58,0; 2 0.58,0
LED-0603 = smd 1 x 1: A -0.877,0; C 0.877,0
SOT886 = smd 0.61 x 0.25: 1 -0.405,0.5 | smd 0.56 x 0.25: 2 -0.43,0; 3 -0.43,-0.5; 4 0.43,-0.5; 5 0.43,0; 6 0.43,0.5
SOD-323 = smd 0.63 x 0.83: A 1.15,0; C -1.15,0
SOT23_BZX = smd 0.6 x 0.7: P1 -0.85,-0.984; P2 0.85,-0.984; P3 0,1.016
0402_MURATA = smd 0.4 x 0.7: P1 -0.4,0; P2 0.4,0
FIDUCIAL-MICRO = smd 0.635 x 0.635: 1 0,0
U.FL = smd 2.2 x 0.85: 1 0,1.375; 2 0,-1.375 | smd 1.05 x 1: FEED 1.525,0; NC -1.525,0
USB-C-16P-2LAYER-PADS = smd 0.3 x 1: A5 -1.25,-0.34; A6 -0.25,-0.34; A7 0.25,-0.34; A8 1.25,-0.34; B5 1.75,-0.34; B6 0.75,-0.34; B7 -0.75,-0.34; B8 -1.75,-0.34 | smd 0.6 x 1: GND -3.225,-0.34; GND2 3.225,-0.34; VBUS1 -2.45,-0.34; VBUS2 2.45,-0.34 | drill 0.4 pad 0.6 long: SHLD1 -4.318,-0.915; SHLD2 4.318,-0.915; SHLD3 -4.318,-5.095; SHLD4 4.318,-5.095 | hole 0.65: -2.89,-1.445; 2.89,-1.445
JST04_1MM_RA = smd 0.6 x 1.35: 1 -1.5,0; 2 -0.5,0; 3 0.5,0; 4 1.5,0 | smd 1.2 x 2: NC1 2.8,-3.675; NC2 -2.8,-3.675
1X11_NO_SILK = drill 1.016 pad 1.88: 1 0,0; 2 2.54,0; 3 5.08,0; 4 7.62,0; 5 10.16,0; 6 12.7,0; 7 15.24,0; 8 17.78,0; 9 20.32,0; 10 22.86,0; 11 25.4,0
1X09_NO_SILK = drill 1.016 pad 1.88: 1 0,0; 2 2.54,0; 3 5.08,0; 4 7.62,0; 5 10.16,0; 6 12.7,0; 7 15.24,0; 8 17.78,0; 9 20.32,0
1X06_NO_SILK = drill 1.016 pad 1.88: 1 0,0; 2 2.54,0; 3 5.08,0; 4 7.62,0; 5 10.16,0; 6 12.7,0
SMT-JUMPER_2_NC_TRACE_SILK = smd 0.66 x 1.27: 1 -0.521,0; 2 0.521,0
SMT-JUMPER_2_NO_SILK = smd 0.635 x 1.27: 1 -0.406,0; 2 0.406,0
SMT-JUMPER_3_2-NC_TRACE_SILK = smd 0.66 x 1.27: 1 -1.041,0; 2 0,0; 3 1.041,0
UBLOX_ZED_F9R = smd 1.1 x 1.1: G1 -7.312,-5.37; G2 -5.212,-5.37; G3 -3.112,-5.37; G4 -1.012,-5.37; G5 1.088,-5.37; G6 3.188,-5.37; G7 5.288,-5.37; G8 7.388,-5.37; G9 7.388,-3.27; G10 5.288,-3.27; G11 3.188,-3.27; G12 1.088,-3.27; G13 -1.012,-3.27; G14 -3.112,-3.27; G15 -5.212,-3.27; G16 -7.312,-3.27; G17 -7.312,-1.17; G18 -5.212,-1.17; G19 -3.112,-1.17; G20 -1.012,-1.17; G21 1.088,-1.17; G22 3.188,-1.17; G23 5.288,-1.17; G24 7.388,-1.17; G25 7.388,0.93; G26 5.288,0.93; G27 3.188,0.93; G28 1.088,0.93; G29 -1.012,0.93; G30 -3.112,0.93; G31 -5.212,0.93; G32 -7.312,0.93; G33 -7.312,3.03; G34 -5.212,3.03; G35 -3.112,3.03; G36 -1.012,3.03; G37 1.088,3.03; G38 3.188,3.03; G39 5.288,3.03; G40 7.388,3.03; G41 7.388,5.13; G42 5.288,5.13; G43 3.188,5.13; G44 1.088,5.13; G45 -1.012,5.13; G46 -3.112,5.13; G47 -5.212,5.13; G48 -7.312,5.13 | smd 0.8 x 1.5: P1 -7.112,-7.62; P2 -6.012,-7.62; P3 -4.912,-7.62; P4 -3.812,-7.62; P5 -2.712,-7.62; P6 -1.612,-7.62; P7 -0.512,-7.62; P8 0.588,-7.62; P9 1.688,-7.62; P10 2.788,-7.62; P11 3.888,-7.62; P12 4.988,-7.62; P13 6.088,-7.62; P14 7.188,-7.62; P28 7.188,7.33; P29 6.088,7.33; P30 4.988,7.33; P31 3.888,7.33; P32 2.788,7.33; P33 1.688,7.33; P34 0.588,7.33; P35 -0.512,7.33; P36 -1.612,7.33; P37 -2.712,7.33; P38 -3.812,7.33; P39 -4.912,7.33; P40 -6.012,7.33; P41 -7.112,7.33 | smd 1.5 x 0.8: P15 9.988,-6.77; P16 9.988,-5.67; P17 9.988,-4.57; P18 9.988,-3.47; P19 9.988,-2.37; P20 9.988,-1.27; P21 9.988,-0.17; P22 9.988,0.93; P23 9.988,2.03; P24 9.988,3.13; P25 9.988,4.23; P26 9.988,5.33; P27 9.988,6.43; P42 -9.912,6.43; P43 -9.912,5.33; P44 -9.912,4.23; P45 -9.912,3.13; P46 -9.912,2.03; P47 -9.912,0.93; P48 -9.912,-0.17; P49 -9.912,-1.27; P50 -9.912,-2.37; P51 -9.912,-3.47; P52 -9.912,-4.57; P53 -9.912,-5.67; P54 -9.912,-6.77
SOT23-5 = smd 0.55 x 1.2: 1 -0.95,-1.3; 2 0,-1.3; 3 0.95,-1.3; 4 0.95,1.3; 5 -0.95,1.3
SOP_8-PIN = smd 1.9 x 0.64: P1 -2.921,2.032; P2 -2.921,0.762; P3 -2.921,-0.508; P4 -2.921,-1.778; P5 2.679,-1.778; P6 2.679,-0.508; P7 2.679,0.762; P8 2.679,2.032
SIP6 = smd 0.3 x 0.52: P1 -0.508,-0.381; P2 -0.008,-0.381; P3 0.492,-0.381; P4 0.492,0.369; P5 -0.008,0.369; P6 -0.508,0.369

### Placement (x,y rotation side)
$1_36_$_2020-02-13_17-32-45  40.64,48.26 0 top
BT1  29.08,43.31 270 top
C1  25.4,34.92 0 top
C2  21.08,13.84 0 top
C3  23.62,41.02 0 top
C4  26.16,38.1 90 top
C5  19.79,34.77 0 top
C12  35.98,17.38 180 top
C15  35.98,6.94 180 top
C16  27.62,5.7 0 top
C17  26.21,13.38 90 top
C18  22.3,10.75 270 top
D1  24.13,2.54 0 top
D2  28.45,2.54 0 top
D3  35.94,2.54 0 top
D4  32.13,2.54 0 top
D5  12.45,41.96 270 top
D6  27.99,38.1 270 top
D9  35.98,9.16 0 top
D10  35.98,15.16 0 top
FB1  17.53,15.62 0 top
FD1  5.08,5.08 0 top
FD2  5.08,5.08 0 bottom
FD3  36.83,46.99 0 top
FD4  36.83,46.99 0 bottom
FRAME1  1.78,-16.26 0 top  (outside the outline)
H1  STAND-OFFTIGHT  [STAND-OFF-TIGHT]  2.54,2.51 0 top
H2  2.54,48.26 0 top
H4  STAND-OFFTIGHT  [STAND-OFF-TIGHT]  40.64,2.51 0 top
J1  16.81,11.96 90 top
J2  12.7,44.48 180 top
J3  5.08,41.91 270 top
J4  38.1,41.91 90 top
J5  41.91,36.83 270 top
J6  1.27,16.51 90 top
J7  34.29,49.53 180 top
JP1  24.64,1.6 0 bottom
JP2  28.45,1.6 0 bottom
JP3  36.07,1.6 0 bottom
JP4  32.13,1.6 0 bottom
JP5  9.47,27.13 90 bottom
JP6  9.65,32 90 bottom
LOGO1  8.89,3.81 0 top
LOGO2  36.07,42.04 270 top
LOGO3  21.59,36.83 0 bottom
R1  19.68,36.83 180 top
R2  35.52,25.47 180 top
R3  35.52,28.37 180 top
R4  9.37,23.09 180 top
R5  9.37,19.97 180 top
R6  9.37,27.76 180 top
R7  9.37,26.2 180 top
R8  9.37,24.64 180 top
R9  9.37,30.84 180 top
R10  9.37,29.41 180 top
R11  35.52,31.37 0 top
R12  35.52,29.87 0 top
R13  35.52,20.44 0 top
R14  35.52,22.06 0 top
R15  9.37,18.41 180 top
R16  9.37,21.53 180 top
R17  21.34,15.62 0 top
R18  6.35,47.75 270 top
R19  9.62,34 0 top
R20  19.05,47.75 270 top
R21  24.13,1.14 0 top
R22  28.45,1.14 0 top
R23  35.94,1.14 0 top
R24  32.13,1.14 0 top
R25  9.62,32.28 0 top
R26  13.97,38.1 270 top
R27  12.45,38.1 270 top
R28  30.12,37.85 270 top
R35  35.98,5.45 180 top
R36  35.98,11.35 180 top
R37  35.98,12.85 180 top
R38  35.98,18.9 180 top
R39  23.36,7.83 270 top
R40  29.97,14.01 90 top
U1  22.86,25.4 0 top
U2  23.62,38.23 180 top
U4  29.81,9.39 180 top
U$1  [INT2]  1.78,24.13 0 top
U$2  [PPS4]  1.78,16.51 0 top
U$3  [3V32]  1.78,34.29 0 top
U$4  [PPS8]  26.67,3.81 0 top
U$5  [PWR10]  22.23,3.81 0 top
U$6  [GND3]  1.78,36.83 0 top
U$7  [#RESET2]  7.49,19.05 0 bottom
U$8  [RTK9]  34.29,3.81 0 top
U$9  [RXI#MOSI5]  35.02,26.73 0 top
U$10  [D#0]  38.73,16.51 0 top
U$11  [SCL0]  1.78,29.21 0 top
U$12  [SDA1]  1.78,31.75 0 top
U$13  [D#1]  38.86,19.05 0 top
U$14  [RXI22]  26.67,49.02 270 top
U$15  [TXO#MISO6]  34.54,24.13 0 top
U$16  [TX_READY0]  1.78,26.67 0 top
U$17  [GND-03]  37.21,36.83 0 top
U$18  [5V0]  38.73,34.29 0 top
U$19  [3V32]  37.97,31.75 0 top
U$20  [GND-03]  34.29,49.15 270 top
U$21  [BLK2]  34.8,49.53 0 top
U$22  [RTK9]  37.72,3.43 0 bottom
U$23  [GRN1]  17.4,49.66 0 top
U$24  [INT2]  5.84,24.13 0 bottom
U$25  [TXO21]  24.13,49.15 270 top
U$26  [CS#-<]-04]  38.1,29.21 0 top
U$27  [PPS1]  6.1,16.51 0 bottom
U$28  [#SAFEBOOT3]  10.03,21.59 0 bottom
U$29  [3V3-04]  41.66,31.75 0 bottom
U$30  [RXI#MOSI0]  41.66,26.67 0 bottom
U$31  [GND-04]  41.53,36.8 0 bottom
U$32  [W#2]  38.48,11.43 0 top
U$33  [5V]  41.66,34.29 0 bottom
U$34  [GND-04]  34.29,44.32 90 bottom
U$35  [RXI28]  26.67,44.32 90 bottom
U$36  [TXO21]  24.13,43.43 90 bottom
U$37  [TXO#MISO1]  41.66,24.13 0 bottom
U$38  [SCL#CLK2]  41.66,21.59 0 bottom
U$39  [SCL5]  5.46,29.21 0 bottom
U$40  [3V3-04]  5.71,34.29 0 bottom
U$41  [GND-04]  6.48,36.8 0 bottom
U$42  [SDA4]  5.71,31.75 0 bottom
U$43  [TXR3]  5.84,26.54 0 bottom
U$44  [#RESET1]  1.52,19.05 0 top
U$45  [SPI4]  11.43,25.02 90 bottom
U$46  [I_SUPER2_C-()-04]  11.63,30.14 90 bottom
U$47  [PPS8]  30.1,3.43 0 bottom
U$48  [PWR10]  26.42,3.43 0 bottom
U$49  [ANT0]  14.86,1.02 0 top
U$50  [W#3]  38.61,13.97 0 top
U$51  [ZED#F9R0]  30.86,27.81 0 bottom
U$52  [U#BLOX1]  29.21,31.24 0 bottom
U$53  [GRN1]  21.08,49.66 0 bottom
U$54  [BLK2]  38.1,49.53 0 bottom
U$55  [#SFBT0]  1.4,21.59 0 top
U$56  [GEO1]  30.35,3.81 0 top
U$57  [SCLK2]  37.47,21.59 0 top
U$58  [GEO1]  34.04,3.43 0 bottom
U$59  [CS#-[>-04]  41.78,29.21 0 bottom
U$60  [D#0]  38.1,18.92 180 bottom
U$61  [D#1]  38.23,16.51 180 bottom
U$62  24.08,11.05 0 top
U$63  27.94,13.08 90 top
U$64  [W#2]  37.72,11.43 180 bottom
U$65  [W#3]  37.85,13.97 180 bottom

### Tracks (layer width: path | path; a pad name or v marks a point on that pad's centre or on a via)
3.3V  (via drill 0.38)
  Top 0.254: D1.A 22.35,2.54 v21.34,1.52 20.57,0.76 10.54,0.76 8.13,3.17 v8.13,5.84 | U4.P8 27.13,5.79 C16.1 23.37,5.7 | C18.1 22.39,11.42 U$62.P6 23.57,12.52 v23.62,12.57 | v21.34,4.32 21.34,4.96 22.08,5.7 23.37,5.7 | R39.2 v23.36,5.84 23.36,5.71 23.37,5.7 | v28.7,14.86 R40.2 | v25.27,12.57 25.99,12.57 C17.1 26.44,12.57 U$63.P6
  Top 0.381: U1.P33 24.57,32.75 24.57,33.91 | U1.P34 23.45,33.73 23.62,33.91 24.57,33.91 | J4.2 v39.37,41.4 | v6.48,42.42 J3.2 | J5.3 41.02,31.75 39.75,33.02 39.75,35.18 v37.78,37.15 | D6.A 26.46,36.95 C4.1 25.84,36.93 U2.5 v24.57,35.87 24.57,34.94 C1.1 24.55,33.92 24.57,33.91 | U1.P38 19.05,34.66 C5.1 19.05,34.89 v19.05,35.81 19.05,36.77 R1.2
  Bottom 0.254: 8.13,32 6.1,32 5.21,32.89 5.21,34.29 | 8.13,32 JP6.2 | v21.34,1.52 v21.34,4.32 | v28.7,14.86 28.57,14.86 26.29,12.57 v25.27,12.57 v23.62,12.57 23.37,12.32 v23.37,5.85 v23.36,5.84 | v8.13,5.84 8.13,32
  Bottom 0.381: v39.37,41.4 39.37,38.73 v37.78,37.15 36.5,35.87 v24.57,35.87 24.51,35.81 v19.05,35.81 7.05,35.81 | v6.48,42.42 6.6,42.42 7.05,41.97 7.05,35.81 | J6.8 5.21,34.29 6.22,34.29 7.05,35.12 7.05,35.81
!RESET
  Top 0.254: J6.4 2.31,23.09 R4.2
!SAFEBOOT
  Top 0.254: R16.2 1.33,21.53 J6.3
D_SEL  (via drill 0.3)
  Top 0.254: U1.P47 11.85,26.33 v11.81,26.29
  Bottom 0.254: v11.81,26.29 11.18,25.65 10.29,25.65 9.6,26.34 9.6,26.59 JP5.1
DIR+
  Top 0.254: R37.1 37.49,12.85 38.35,13.72 38.35,16 38.86,16.51 J5.9
DIR-  (via drill 0.38)
  Top 0.254: v34.67,16.51 34.67,17.14 34.9,17.38 C12.2 35.4,16.23 35.13,15.96 D10.P1 34.5,14.18 34.16,13.84 34.16,10.29 33.78,9.9 U4.P3 | v37.59,17.4 39.24,19.05 J5.8
  Bottom 0.254: v37.59,17.4 37.21,17.02 35.18,17.02 v34.67,16.51
DIR_IN
  Top 0.254: U4.P4 32.73,11.43 33.75,12.44 33.75,16.35 34.16,16.76 34.16,18.67 34.39,18.9 R38.2
DIR_OUT  (via drill 0.38)
  Top 0.254: R3.1 36.66,28.37 37.47,27.56 v37.47,23.5 | U$63.P4 27.57,15 28.32,15.75 v32.51,15.75
  Bottom 0.254: v32.51,15.75 33.02,15.75 34.8,17.53 36.58,17.53 37.47,18.41 v37.47,23.5
DIR_SCHMITT  (1 unrouted)
  Top 0.254: U4.P6 28.95,9.9 31.52,12.47 | U$63.P2 29.88,13.07 R40.1 30.24,13.43
DMINUS
  Top 0.254: R26.2 15.53,35.69 17.02,35.69 17.95,34.76 U1.P39
DPLUS
  Top 0.254: U1.P40 16.89,32.77 16.89,34.16 16,35.05 14.1,35.05 12.45,36.7 R27.2
GEOF_STAT  (via drill 0.38)
  Top 0.254: D4.A 31.25,3.06 32.64,4.45 37.72,4.45 39.12,5.84 v39.12,9.65 | v38.99,20.32 36.22,20.32 R13.2
  Bottom 0.254: v39.12,9.65 39.12,20.19 v38.99,20.32
GND  (via drill 0.3)
  Top 0.254: D5.2 12.45,43.05 v12.57,43.18
  Top 0.381: U2.2 23.62,40.17 C3.2
  other vias: 14.48,31.5 16.71,31.2 18.79,31.2 20.9,31.2 23.01,31.2 25.12,31.2 27.2,31.2 29.31,31.18 31.49,31.23 14.5,29.42 16.71,29.42 18.79,29.42 20.9,29.42 23.01,29.42 25.12,29.42 27.2,29.42 29.31,29.4 31.49,29.45 14.5,27.24 16.71,27.24 18.79,27.24 20.9,27.24 23.01,27.24 25.12,27.24 27.2,27.24 29.31,27.21 31.49,27.26 14.48,25.15 16.71,25.16 18.79,25.16 20.9,25.16 25.12,25.16 27.2,25.16 29.31,25.13 31.49,25.18 14.5,23.02 16.71,23.02 18.79,23.02 20.9,23.02 23.01,23.02 25.12,23.02 27.2,23.02 29.31,23 31.49,23.05 14.48,20.99 16.69,20.99 18.77,20.99 20.88,20.99 22.99,20.99 25.09,20.99 27.18,20.99 29.28,20.97 31.47,21.02 14.48,19.05 16.58,19.18 18.79,19.06 20.9,19.06 23.01,19.06 25.12,19.06 27.2,19.06 29.31,19.04 30.23,19.05 13.97,11.43 12.7,3.81 12.7,6.35 12.7,16.51 6.35,16.51 6.35,6.35 6.35,3.81 6.35,1.27 8.89,1.27 3.81,16.51 3.81,6.35 1.27,6.35 5.08,30.48 5.08,27.94 4.32,33.4 5.08,38.1 10.16,39.37 10.16,41.91 7.62,43.18 8.89,40.64 40.64,27.94 33.02,34.29 30.48,34.29 27.94,34.29 14.48,33.36 14.48,32.47 15.52,31.5 30.99,17.31 30.99,18.2 30.99,19.05 20.32,43.18 22.86,43.18 25.4,43.18 25.4,45.72 22.86,45.72 20.32,45.72 17.78,43.18 22.86,48.26 19.05,49.53 20.32,48.26 27.94,45.72 30.48,45.72 30.48,43.18 33.02,43.18 33.02,45.72 35.56,45.72 35.56,48.26 36.83,49.53 38.1,45.72 41.91,43.18 41.91,40.64 15.24,13.97 15.24,15.24 19.68,11.43 19.68,12.57 19.68,10.16 18.41,9.78 15.24,9.78 13.97,10.16 13.97,12.57 20.32,39.37 17.78,39.37 15.24,39.37 14.48,18.07 14.48,17.16 15.59,19.05 10.16,3.81 13.97,34.29 1.27,43.18 1.27,40.64 6.35,49.53 33.02,40.01 29.08,40.01 26.16,40.01 3.81,43.18 6.35,45.72 5.21,35.18 38.1,39.37 35.56,41.91 10.16,6.35 10.16,16.51 29.34,5.71 5.08,25.4 11.43,34.92 35.56,34.29 37.34,29.08 13.97,13.97 15.24,16.38 18.16,14.22 17.6,19.05 16.76,11.56 22.83,25.16 37.34,32.89 4.32,32.13 4.19,35.18 3.81,27.94 26.16,15.24 25.53,10.54 26.04,6.48 29.21,7.62 28.96,11.18 28.83,14.1 32.77,14.86 32.77,13.08 15.24,6.35 15.24,3.81 17.78,6.35 17.78,3.81 20.32,6.35 20.32,3.81 20.32,8.89 17.78,8.89 15.24,8.89 12.7,8.89 10.16,8.89 10.16,11.43 12.7,11.43 12.7,13.97 10.16,13.97 6.35,13.97 6.35,11.43 6.35,8.89 3.81,11.43 3.81,13.97 1.27,13.97 1.27,11.43 1.27,8.89 3.81,8.89 22.86,4.45 25.4,4.45 27.94,4.45 30.48,4.45 31.75,5.71 33.78,5.71 30.86,9.4 23.88,13.97 22.23,8.89 19.3,13.84 23.88,15.88 21.59,34.82
  pour Top (isolate 0.203, rank 2): 0,50.8 43.18,50.8 43.18,0 0,0
  pour Bottom (isolate 0.203, rank 2): 0,50.8 43.18,50.8 43.18,0 0,0
INT
  Top 0.254: J6.2 2.19,19.97 R5.2
N$1  (via drill 0.3)
  Top 0.254: R25.2 10.43,32.51 v11.18,32.51
  Bottom 0.254: v11.18,32.51 11.18,31.5 10.67,30.99 9.68,30.99 JP6.1
N$2
  Top 0.254: D6.C 27.99,38.87 29.86,37 R28.2
N$3  (via drill 0.3)
  Top 0.254: R19.2 10.42,33.78 v11.18,33.78
  Bottom 0.254: JP6.3 10.44,33.05 v11.18,33.78
N$4
  Top 0.254: D1.C 25.01,1.44 R21.2
N$5
  Top 0.508: FB1.P2 R17.1 20.49,13.86 C2.1
N$6
  Top 0.254: J2.A6 12.95,45.72 12.7,45.97 12.19,45.97 11.95,45.73 J2.B6 11.94,44.8 11.94,42.4 D5.3
N$7
  Top 0.254: 13.45,43.81 J2.B7 | J2.A7 12.45,44.06 12.7,43.81 13.45,43.81 | D5.1 12.95,42.66 13.45,43.17 13.45,43.81
N$8  (via drill 0.38)
  Top 0.254: R21.1 22.35,1.14 v22.23,1.27
  Bottom 0.254: v22.23,1.27 22.55,1.6 JP1.2
N$9
  Top 0.254: D5.6 12.95,41.16 13.97,40.13 R26.1
N$10
  Top 0.254: D5.4 11.95,39.45 R27.1
N$11
  Top 0.254: R4.1 10.51,23.09 11.56,24.13 U1.P49
N$12
  Top 0.254: R5.1 10.71,19.97 11.56,20.82 11.56,21.46 12.02,21.93 U1.P51
N$14
  Top 0.254: J2.B5 10.95,46.45 10.23,47.17 R18.2
N$15
  Top 0.254: J2.A5 13.95,46.46 14.53,47.05 18.92,47.05 R20.2
N$16
  Top 0.254: R6.1 10.2,27.76 12.07,29.63 U1.P44
N$17
  Top 0.254: R7.1 10.45,26.2 10.79,26.54 10.79,27.43 11.89,28.53 U1.P45
N$18
  Top 0.254: R8.1 10.42,24.64 11.3,25.53 11.3,26.92 11.81,27.43 U1.P46
N$19
  Top 0.254: R9.1 10.46,30.84 11.44,31.83 U1.P42
N$20
  Top 0.254: R10.1 10.58,29.41 11.9,30.73 U1.P43
N$21
  Top 0.254: U1.P27 33.58,31.83 34.04,31.37 R11.1
N$22  (via drill 0.38)
  Top 0.254: R23.1 v34.04,1.14
  Bottom 0.254: v34.04,1.14 34.49,1.6 JP3.2
N$23  (via drill 0.38)
  Top 0.254: R22.1 27.74,1.27 v26.16,1.27
  Bottom 0.254: v26.16,1.27 26.49,1.6 JP2.2
N$24
  Top 0.254: D2.C 29.32,1.44 R22.2
N$25
  Top 0.254: D3.C 36.82,1.44 R23.2
N$26
  Top 0.254: U1.P26 33.66,30.73 34.52,29.87 R12.1
N$27
  Top 0.254: U1.P19 33.74,23.03 34.04,22.73 34.04,20.7 34.3,20.43 R13.1
N$28
  Top 0.254: R14.1 34.54,22.46 34.54,23.62 34.04,24.13 U1.P20
N$29
  Top 0.254: U1.P53 11.86,19.73 10.54,18.41 R15.1
N$30
  Top 0.254: U1.P50 12.11,23.03 10.61,21.53 R16.1
N$31
  Top 0.254: U1.P22 33.61,26.33 34.47,25.47 R2.2
N$32
  Top 0.254: U1.P23 33.74,27.43 34.67,28.37 R3.2
N$33  (via drill 0.3)
  Top 0.254: R24.1 30.61,1.14 v30.48,1.27
  Bottom 0.254: v30.48,1.27 30.81,1.6 JP4.2
N$34
  Top 0.254: R24.2 33.01,1.44 D4.C
N$35
  Top 0.254: R36.1 36.83,11.03 D9.P3 35.98,7.96 36.56,7.38 C15.1 36.56,6.88 R35.2
N$37
  Top 0.254: R37.2 35.98,13.7 D10.P3 36.56,16.76 C12.1 36.56,18.63 R38.1
PPS  (via drill 0.3, 0.38)
  Top 0.254: J6.1 3.17,18.41 7.62,18.41 | 7.62,18.41 R15.2 | D2.A 26.8,2.54 25.91,3.43 22.35,3.43 21.53,2.6 20.19,1.27 10.92,1.27 8.89,3.3 v8.89,5.08 | v8.89,16.51 7.62,17.78 7.62,18.41
  Bottom 0.254: v8.89,5.08 v8.89,16.51
RF_IN
  Top 1: 16.82,15.11 J1.FEED
  pour Top (no thermals): 16.38,18.36 16.38,14.86 17.27,14.86 17.27,18.36
RTK_STAT  (via drill 0.38)
  Top 0.254: D3.A 35.06,3.31 35.56,3.81 37.85,3.81 39.75,5.71 v39.75,10.54 | v38.99,21.21 38.13,22.06 R14.2
  Bottom 0.254: v39.75,10.54 39.75,20.45 v38.99,21.21
RXI2
  Top 0.254: J7.4 26.67,48.64 28.07,47.24 33.15,47.24 34.54,45.85 34.54,33.78 35.43,32.89 36.2,32.89 37.08,32 37.08,30.21 36.74,29.87 R12.2
RXI/MOSI  (via drill 0.38)
  Top 0.254: v36.07,37.59 39.12,34.54 39.12,26.92 39.37,26.67 J5.5 | v9.91,37.08 9.65,36.83 9.27,36.83 7.11,34.67 7.11,30.23 7.93,29.41 R10.2
  Bottom 0.254: v36.07,37.59 10.41,37.59 v9.91,37.08
SCL/CLK  (via drill 0.3, 0.38)
  Top 0.254: v36.7,43.43 38.08,43.43 J4.4 38.12,43.43 v39.24,43.43 | J5.7 40.26,21.59 38.1,23.75 38.1,34.04 37.34,34.8 v37.21,34.8 | J6.6 2.54,29.21 3.43,30.1 3.43,39.88 3.96,40.41 J3.4 6.07,40.41 8.13,38.35 v8.13,37.59 8.13,37.47 5.97,35.31 v5.97,33.66 | R7.2 7.71,26.2 5.97,27.94 v5.97,33.66 | v5.97,33.66 | R19.1 9.04,34.82 v9.27,35.05
  Bottom 0.254: v8.13,37.59 8.38,37.59 9.4,38.61 34.54,38.61 36.2,40.26 36.2,42.93 v36.7,43.43 | v39.24,43.43 39.5,43.43 40.13,42.8 40.13,38.48 37.21,35.56 v37.21,34.8 | v9.27,35.05 7.87,33.66 v5.97,33.66
SDA/!CS  (via drill 0.3, 0.38)
  Top 0.254: v36.83,42.29 36.95,42.41 J4.3 38.15,42.46 39.47,42.46 40.13,41.79 40.13,41.02 39.37,40.26 39.37,37.72 v40.26,36.83 | J6.7 2.67,31.75 2.92,32 2.92,40.26 4.07,41.41 J3.3 6.34,41.41 9.27,38.48 v9.27,37.59 6.6,34.92 v6.6,32.64 6.48,32.51 6.48,28.7 7.42,27.76 R6.2 | R25.1 8.99,32.28 v8.26,33.02
  Bottom 0.254: v9.27,37.59 9.78,38.1 35.18,38.1 36.83,39.75 v36.83,42.29 | v40.26,36.83 40.26,30.86 J5.4 | v8.26,33.02 7.87,32.64 v6.6,32.64
SHIELD  (via drill 0.38)
  other vias: 9.27,46.48 10.16,48.26 15.24,48.26 14.73,46.35
  pour Top (no thermals): 8.13,50.8 17.27,50.8 17.27,44.83 8.13,44.83
  pour Bottom (no thermals): 17.27,50.8 8.13,50.8 8.13,44.83 17.27,44.83
TX_READY
  Top 0.254: R8.2 3.29,24.64 J6.5
TXO2
  Top 0.254: J7.5 26.92,46.74 32.89,46.74 34.04,45.59 34.04,33.53 35.18,32.38 35.81,32.38 36.1,32.09 R11.2
TXO/MISO  (via drill 0.38)
  Top 0.254: v35.43,36.96 36.07,36.96 38.61,34.42 38.61,25.78 40.26,24.13 J5.6 | v10.79,36.7 9.78,35.69 8.89,35.69 7.62,34.42 7.62,31.5 8.28,30.84 R9.2
  Bottom 0.254: v35.43,36.96 11.05,36.96 v10.79,36.7
V_BATT  (via drill 0.38)
  Top 0.254: U1.P36 21.25,33.57 22.1,34.42 22.1,35.43 21.59,35.94 v21.59,39.37 | R28.1 30.67,39.24 v31.39,39.24 31.39,41.01 BT1.+
  Bottom 0.254: v31.39,39.24 31.27,39.12 21.84,39.12 v21.59,39.37
V_RF
  Top 0.508: U1.P7 22.35,15.78 R17.2
VIN  (via drill 0.38)
  Top 0.254: J2.VBUS1 15.15,43.98 v14.92,43.75 | J2.VBUS2 10.25,43.65 v10.16,43.56 | D5.5 12.45,40.64 v12.83,40.26
  Top 0.381: U2.1 24.57,38.67 24,38.1 23.24,38.1 22.67,38.67 U2.3 22.67,40.79 | 22.67,40.79 22.67,40.92 C3.1 | 22.67,40.79 22.61,40.85 v21.59,40.85 14.99,40.85 v14.92,40.92 v14.92,43.75 | J5.2 41.66,34.29 v35.18,40.77
  Bottom 0.254: v14.92,43.75 14.61,44.07 10.67,44.07 v10.16,43.56 | v12.83,40.26 14.22,40.26 14.88,40.92 v14.92,40.92
  Bottom 0.381: v35.18,40.77 35.05,40.89 21.63,40.89 v21.59,40.85
WT+
  Top 0.254: R35.1 37.83,5.45 38.48,6.1 38.48,10.54 39.37,11.43 J5.11
WT-  (via drill 0.38)
  Top 0.254: D9.P1 35.15,8.16 35.15,7.2 C15.2 35.36,6.99 v34.42,6.99 33.91,6.48 31.5,6.48 31.11,6.86 31.11,8.26 31.49,8.63 U4.P2 | J5.10 39.37,13.97 38.1,12.7 38.1,7.49 v37.59,6.99
  Bottom 0.254: v37.59,6.99 v34.42,6.99
WT_IN
  Top 0.254: U4.P1 33.65,7.36 34.54,8.26 34.54,10.76 R36.2
WT_OUT  (via drill 0.38)
  Top 0.254: U$62.P4 24.57,14.92 25.78,16.13 31.62,16.13 v31.88,16.38 | v36.83,22.99 36.87,23.02 36.87,24.71 R2.1
  Bottom 0.254: v31.88,16.38 33.02,16.38 34.67,18.03 36.32,18.03 36.83,18.54 v36.83,22.99
WT_SCHMITT  (1 unrouted)
  Top 0.254: U$62.P2 24.07,9.39 R39.1 24.62,8.68 | U4.P7 25.11,8.63

### Text on the board
Bottom: v10
tPlace: - | +
Measures: Units In Inches
tDocu: Elias Santistevan